# Altium schematic sheet BaseFrequencyConstants.SCHDOC
size B; Organization: Altium Limited; Address1: L3, 12a Rodborough Rd; Address2: Frenchs Forest; Address3: NSW; Address4: Australia 2086; DocumentNumber: 3; SheetNumber: 3; SheetTotal: 9
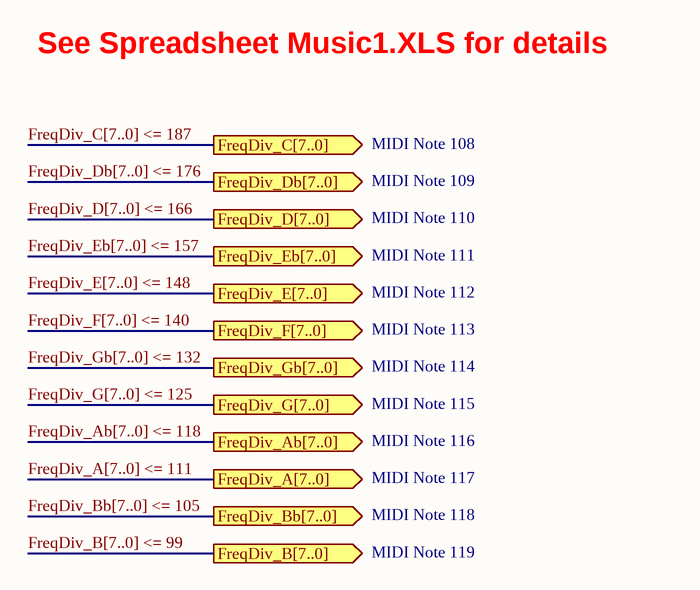
[diagram p0: BaseFrequencyConstants.SCHDOC]

## Ports
FreqDiv_A[7..0] (out), FreqDiv_Ab[7..0] (out), FreqDiv_B[7..0] (out), FreqDiv_Bb[7..0] (out), FreqDiv_C[7..0] (out), FreqDiv_D[7..0] (out), FreqDiv_Db[7..0] (out), FreqDiv_E[7..0] (out), FreqDiv_Eb[7..0] (out), FreqDiv_F[7..0] (out), FreqDiv_G[7..0] (out), FreqDiv_Gb[7..0] (out)

## Buses and harness runs
bus FreqDiv_A[7..0] <= 111 = port FreqDiv_A[7..0]
bus FreqDiv_Ab[7..0] <= 118 = port FreqDiv_Ab[7..0]
bus FreqDiv_B[7..0] <= 99 = port FreqDiv_B[7..0]
bus FreqDiv_Bb[7..0] <= 105 = port FreqDiv_Bb[7..0]
bus FreqDiv_C[7..0] <= 187 = port FreqDiv_C[7..0]
bus FreqDiv_D[7..0] <= 166 = port FreqDiv_D[7..0]
bus FreqDiv_Db[7..0] <= 176 = port FreqDiv_Db[7..0]
bus FreqDiv_E[7..0] <= 148 = port FreqDiv_E[7..0]
bus FreqDiv_Eb[7..0] <= 157 = port FreqDiv_Eb[7..0]
bus FreqDiv_F[7..0] <= 140 = port FreqDiv_F[7..0]
bus FreqDiv_G[7..0] <= 125 = port FreqDiv_G[7..0]
bus FreqDiv_Gb[7..0] <= 132 = port FreqDiv_Gb[7..0]

## Notes on the sheet
- See Spreadsheet Music1.XLS for details
- MIDI Note 108
- MIDI Note 109
- MIDI Note 110
- MIDI Note 111
- MIDI Note 112
- MIDI Note 113
- MIDI Note 114
- MIDI Note 115
- MIDI Note 116
- MIDI Note 117
- MIDI Note 118
- MIDI Note 119
- Title
- Size:
- Date:
- B
- Number:
- Time:
- Revision:
- Sheet
- of
- File: